# EAGLE design SAMD11 Arduino Form Factor (EAGLE 9.4.2)
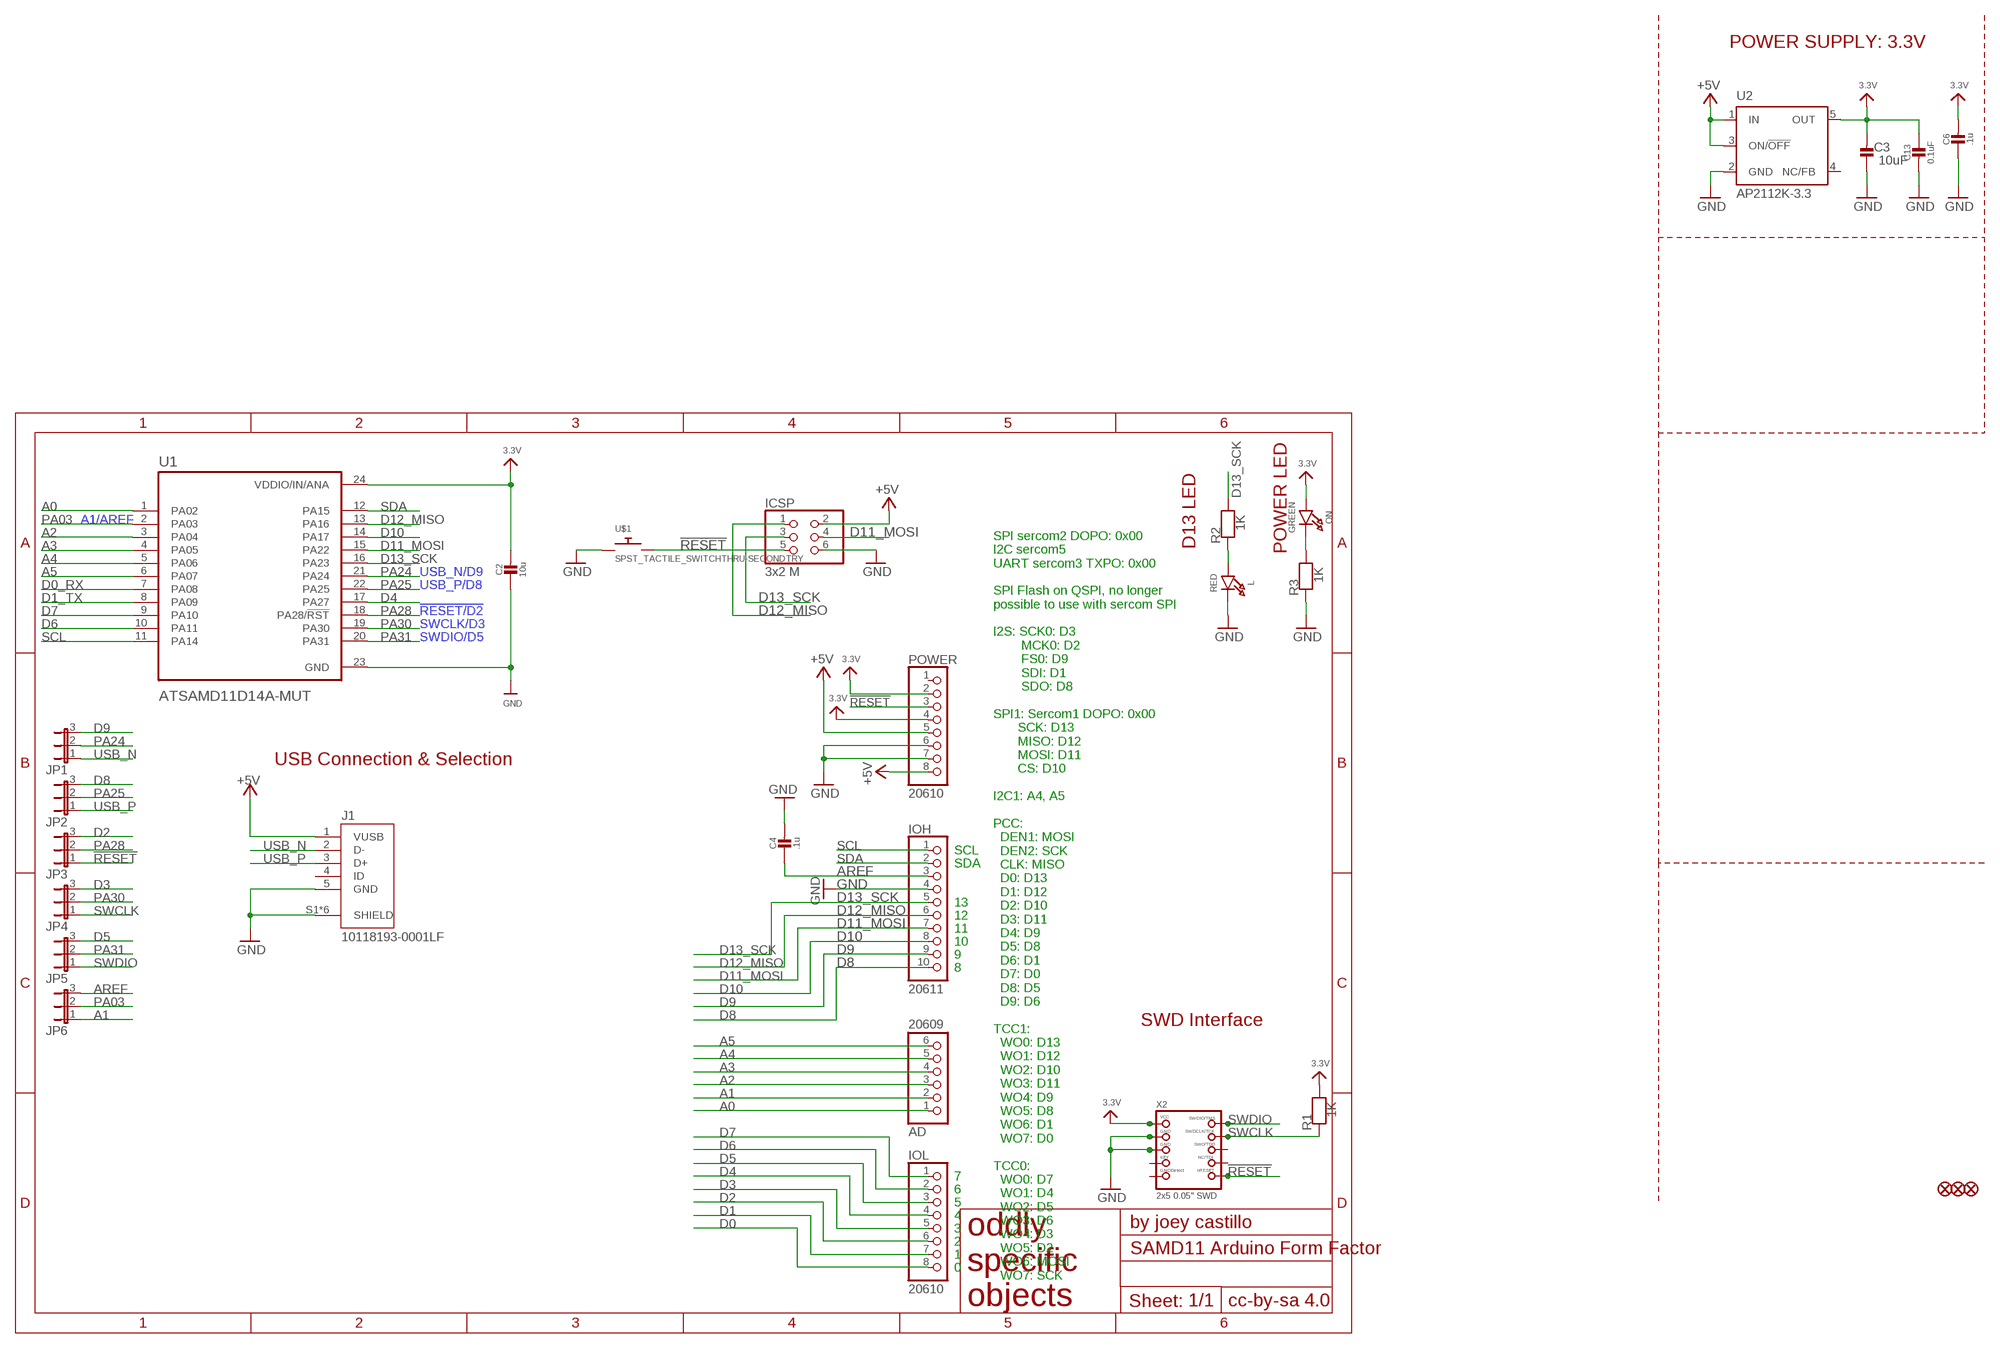
[diagram p0: schematic, sheet 1]

## Parts
AD  20609  HEADER-1X6OVALWAVE  [1X06_OVALWAVE]
C2  10u  CAP_CERAMIC0805-NOOUTLINE  [0805-NO]
C3  10uF  CAP_CERAMIC0805-NOOUTLINE  [0805-NO]
C4  .1u  CAP_CERAMIC0805-NOOUTLINE  [0805-NO]
C6  .1u  CAP_CERAMIC0805-NOOUTLINE  [0805-NO]
C13  0.1uF  CAP_CERAMIC0805-NOOUTLINE  [0805-NO]
FD1  FIDUCIAL_1MM  [FIDUCIAL_1MM]
FD2  FIDUCIAL_1MM  [FIDUCIAL_1MM]
FD3  FIDUCIAL_1MM  [FIDUCIAL_1MM]
ICSP  3x2 M  HEADER-2X3  [2X03_ROUND_70MIL]
IOH  20611  HEADER-1X10OVALWAVE  [1X10_OVALWAVE]
IOL  20610  HEADER-1X8OVALWAVE  [1X08_OVALWAVE]
J1  10118193-0001LF  [FCI_10118193-0001LF]
JP1  JP2E  [JP2]
JP2  JP2E  [JP2]
JP3  JP2E  [JP2]
JP4  JP2E  [JP2]
JP5  JP2E  [JP2]
JP6  JP2E  [JP2]
L  RED  LED0805_NOOUTLINE  [CHIPLED_0805_NOOUTLINE]
ON  GREEN  LED0805_NOOUTLINE  [CHIPLED_0805_NOOUTLINE]
POWER  20610  HEADER-1X8OVALWAVE  [1X08_OVALWAVE]
R1  1K  RESISTOR0805_NOOUTLINE  [0805-NO]
R2  1K  RESISTOR0805_NOOUTLINE  [0805-NO]
R3  1K  RESISTOR0805_NOOUTLINE  [0805-NO]
U1  ATSAMD11D14A-MUT  [QFN50P400X400X90-25N]
U2  AP2112K-3.3  LP2985-XXDBVR33  [SOT23-DBV]
U$1  SPST_TACTILE_SWITCHTHRU-SECONDTRY  [MJTP1250-TRY2]
X2  2x5 0.05" SWD  JTAG-CORTEXBOXPOSTS  [2X05_1.27MM_BOX_POSTS]

## Nets
3.3V: C2.2 C3.2 C6.2 C13.1 ON.A POWER.2 POWER.4 R1.2 U1.24(VDDIO/IN/ANA) U2.5(OUT) X2.1(VCC)
!RESET: ICSP.5 JP3.1 POWER.3 U$1.P$2 X2.10(NRESET)
+5V [usbvcc]: ICSP.2 POWER.5 POWER.8 U2.1(IN) U2.3(ON/!OFF)
A0: AD.1 U1.1(PA02)
A1: AD.2 JP6.1
A2: AD.3 U1.3(PA04)
A3: AD.4 U1.4(PA05)
A4: AD.5 U1.5(PA06)
A5: AD.6 U1.6(PA07)
AREF [aref]: C4.1 IOH.3 JP6.3
D0: IOL.8
D0_RX: U1.7(PA08)
D1: IOL.7
D1_TX: U1.8(PA09)
D2: IOL.6 JP3.3
D3: IOL.5 JP4.3
D4: IOL.4 U1.17(PA27)
D5: IOL.3 JP5.3
D6: IOL.2 U1.10(PA11)
D7: IOL.1 U1.9(PA10)
D8: IOH.10 JP2.3
D9: IOH.9 JP1.3
D10: IOH.8 U1.14(PA17)
D11_MOSI: ICSP.4 IOH.7 U1.15(PA22)
D12_MISO: ICSP.1 IOH.6 U1.13(PA16)
D13_SCK: ICSP.3 IOH.5 R2.2 U1.16(PA23)
GND [gnd]: C2.1 C3.1 C4.2 C6.1 C13.2 ICSP.6 IOH.4 J1.5(GND) J1.S1(SHIELD) J1.S2(SHIELD) J1.S3(SHIELD) J1.S4(SHIELD) J1.S5(SHIELD) J1.S6(SHIELD) L.C POWER.6 POWER.7 R3.1 U1.23(GND) U2.2(GND) U$1.P$1 X2.3(GND) X2.5(GND)
N$1: L.A R2.1
N$3: ON.C R3.2
N$6: J1.1(VUSB) ; supply symbol labelled +5V
PA03: JP6.2 U1.2(PA03)
PA24: JP1.2 U1.21(PA24)
PA25: JP2.2 U1.22(PA25)
PA28: JP3.2 U1.18(PA28/!RST)
PA30: JP4.2 U1.19(PA30)
PA31: JP5.2 U1.20(PA31)
SCL: IOH.1 U1.11(PA14)
SDA: IOH.2 U1.12(PA15)
SWCLK: JP4.1 R1.1 X2.4(SWDCLK)
SWDIO: JP5.1 X2.2(SWDIO)
USB_N: J1.2(D-) JP1.1
USB_P: J1.3(D+) JP2.1
Unconnected: J1.4(ID) POWER.1 U2.4(NC/FB) X2.6(SWO) X2.7(KEY) X2.8(TDI) X2.9(GNDDETECT)

## Notes on the sheet
- POWER SUPPLY: 3.3V
- POWER LED
- D13 LED
- A1/AREF
- USB_N/D9
- USB_P/D8
- !RESET/D2
- SWCLK/D3
- SWDIO/D5
- USB Connection & Selection
- SCL
- SDA
- 13
- 12
- 11
- 10
- 9
- 8
- SWD Interface
- 7
- 6
- 5
- 4
- 3
- 2
- 1
- 0
- SPI sercom2 DOPO: 0x00
  I2C sercom5
  UART sercom3 TXPO: 0x00
  
  SPI Flash on QSPI, no longer
  possible to use with sercom SPI
  
  I2S: SCK0: D3
          MCK0: D2
          FS0: D9
          SDI: D1
          SDO: D8
  
  SPI1: Sercom1 DOPO: 0x00
         SCK: D13
         MISO: D12
         MOSI: D11
         CS: D10
  
  I2C1: A4, A5
  
  PCC:
    DEN1: MOSI
    DEN2: SCK
    CLK: MISO
    D0: D13
    D1: D12
    D2: D10
    D3: D11
    D4: D9
    D5: D8
    D6: D1
    D7: D0
    D8: D5
    D9: D6
  
  TCC1:
    WO0: D13
    WO1: D12
    WO2: D10
    WO3: D11
    WO4: D9
    WO5: D8
    WO6: D1
    WO7: D0
  
  TCC0:
    WO0: D7
    WO1: D4
    WO2: D5
    WO3: D6
    WO4: D3
    WO5: D2
    WO6: MOSI
    WO7: SCK

## Library data of the parts
AD = microbuilder:HEADER-1X6: PIN HEADER
C2-C4 C6 C13 = microbuilder:CAP_CERAMIC: Ceramic Capacitors For new designs, use the packages preceded by an '_' character since they are more reliable: The following footprints should be used on most boards: _0402 - Standard footprint for regular board layouts _0603 - Standard footprint for regular board layouts _0805 - Standard footprint for regular board layouts _1206 - Standard footprint for regular board layouts For extremely tight-pitch boards where space is at a premium, the following 'micro-pitch' footprints can be used (smaller pads, no silkscreen outline, etc.): _0402MP - Micro-pitch footprint for very dense/compact boards _0603MP - Micro-pitch footprint for very dense/compact boards _0805MP - Micro-pitch footprint for very dense/compact boards _1206MP - Micro-pitch footprint for very dense/compact boards
FD1-FD3 = microbuilder:FIDUCIAL: Fiducial Alignment Points Various fiducial points for machine vision alignment.; BOM: EXCLUDE
ICSP = microbuilder:HEADER-2X3: PIN HEADER
IOH = microbuilder:HEADER-1X10: PIN HEADER
IOL POWER = microbuilder:HEADER-1X8: PIN HEADER
J1 = 10118193-0001LF:10118193-0001LF: Micro USB B Type Receptacle; DESCRIPTION: Single Port 5 Contact Shielded SMT MICRO USB B-Type Receptacle; DIGI-KEY_PART_NUMBER: 609-4616-1-ND; DIGI-KEY_PURCHASE_URL: https://www.digikey.com/product-detail/en/amphenol-icc-fci/10118193-0001LF/609-4616-1-ND/2785380?utm_source=snapeda&utm_medium=aggregator&utm_campaign=symbol; MF: Amphenol ICC; MP: 10118193-0001LF; PACKAGE: None
JP1-JP6 = jumper:JP2E: JUMPER
L ON = microbuilder:LED: LED 0603 - 0603 Surface Mount Package 2mA: Green LED - Low Power (3.9mcd, 2ma, 1.7Vf) - Digikey: 475-2709-2-ND Orange LED - Low Power (9.8mcd, 2ma, 1.8Vf) - Digikey: 475-1194-2-ND Red LED - Low Power (5mcd, 2ma, 1.8Vf) - Digikey: 475-1195-2-ND Yellow LED - Low Power (7mcd, 2ma, 1.8Vf) - Digikey: 475-1196-2-ND 5mA: Blue LED - Low Power (17mcd, 5ma, 2.9Vf) - Digikey: LNJ937W8CRACT-ND 0805 - 0805 Surface Mount Package 2mA: Red LED (8.8mcd, 2mA, 1.8Vf, Clear) - Low Power [Digikey: 475-2510-1-ND] Green LED (5mcd, 2mA, 1.8Vf, Clear) - Low Power [Digikey: 475-2730-1-ND] Yellow LED (11.3mcd, 2mA, 1.8Vf, Clear) - Low Power [Digikey: 475-2555-1-ND] 20mA: Red LED (104mcd, 20mA, Diffused) - LS R976 [Digikey: 475-1278-6-ND] Red LED (12mcd, 20mA, 2.0Vf, Clear) - APT2012EC [Digikey: 754-1128-1-ND] Green LED (15mcd, 20mA, 2.2Vf, Clear) - APT2012GC [Digikey: 754-1131-1-ND] Orange LED (160mcd, 20mA, 2.1Vf, Clear) - APT2012SECK [Digikey: 754-1130-1-ND] 1206 - 1206 Surface Mount Package Green LED (26mcd, 20mA, Diffused) - LG N971 [Digikey: 475-1407-6-ND] Red LED (15mcd, 20mA, Diffused) - LH N974 [Digikey: 475-1416-6-ND] Cree - Cree High-Power Surface Mount LEDs XPEBWT-L1-0000-00D50 - White 111lm 350mA 2.9Vf 6200K 110° XTEAWT-00-0000-00000LEE3 - White 114lm 350mA 2.85Vf 5000K 115° Everlight - Everlight 45-21 Series Surface Mount LEDs 45-21/QK2C-B2832AC2CB2/2T - Warm White 2000mcd 20mA 3.25Vf 3050K 120° 45-21/LK2C-B38452C4CB2/2T - Nuetral White 2000mcd 20mA 3.25Vf 4150K 120° 45-21/LK2C-B50634C6CB2/2T - Cold White 2200mcd 20mA 3.25Vf 5650K 120° PLCC2 Reverse Mount LS T77K-J1L2-1-0-2-R18-Z - Red 11.25mcd 2mA 1.8Vf 630nm 120° LO T77K-L1M2-24-Z - Orange 19.6mcd 2mA 1.8Vf 606nm 120° LY T77K-K2M1-26-Z - Yellow 15.7mcd 2mA 1.8Vf 587nm 120°
R1-R3 = microbuilder:RESISTOR: Resistors For new designs, use the packages preceded by an '_' character since they are more reliable: The following footprints should be used on most boards: _0402 - Standard footprint for regular board layouts _0603 - Standard footprint for regular board layouts _0805 - Standard footprint for regular board layouts _1206 - Standard footprint for regular board layouts For extremely tight-pitch boards where space is at a premium, the following 'micro-pitch' footprints can be used (smaller pads, no silkscreen outline, etc.): _0402MP - Micro-pitch footprint for very dense/compact boards _0603MP - Micro-pitch footprint for very dense/compact boards _0805MP - Micro-pitch footprint for very dense/compact boards _1206MP - Micro-pitch footprint for very dense/compact boards
U1 = ATSAMD11D14A-MUT:ATSAMD11D14A-MUT: None; AVAILABILITY: Unavailable; DESCRIPTION: Cortex-M0+, 16KB FLASH, 4KB SRAM, USB - 24 QFN, INDUSTRIAL, GREEN, 1.6-3.6V, 48MHz/ QFN _ZA_; MF: Microchip; MP: ATSAMD11D14A-MUT; PACKAGE: QFN-24 Microchip; PRICE: None
U2 = SmartPrj:LP2985-XXDBVR: ULTRALOW-POWER 50-mA LOW-DROPOUT LINEAR REGULATORS 50-mA Low-Dropout Regulator Source: http://focus.ti.com/lit/ds/symlink/tps77001.pdf
U$1 = My Stuff:SPST_TACTILE_SWITCH
X2 = microbuilder:JTAG-CORTEX: Serial Wire (SW-DP) Connector Standard 0.05" 10-pin connector is for use with the Cortex M and Cortex A SWD (serial wire debugger) interface (SW-DP) Connectors 2x05_1.27MM_SMT - Inexpensive surface-mount header with bare pins, compatible with standard 10-pin SWD cables (4UCON: 16846) 2x05_1.27MM_BOX_NOPOSTS - Polarised surface-mount box (4UCON with caps: 19735, without caps: 15117 2x05_1.27MM_BOX_POSTS - Polarised surface-mount box with mounting holes (4UCON: 20317) Pinout: http://infocenter.arm.com/help/topic/com.arm.doc.faqs/attached/13634/cortex_debug_connectors.pdf http://www.keil.com/peripherals/coresight/connectors.asp

## Board
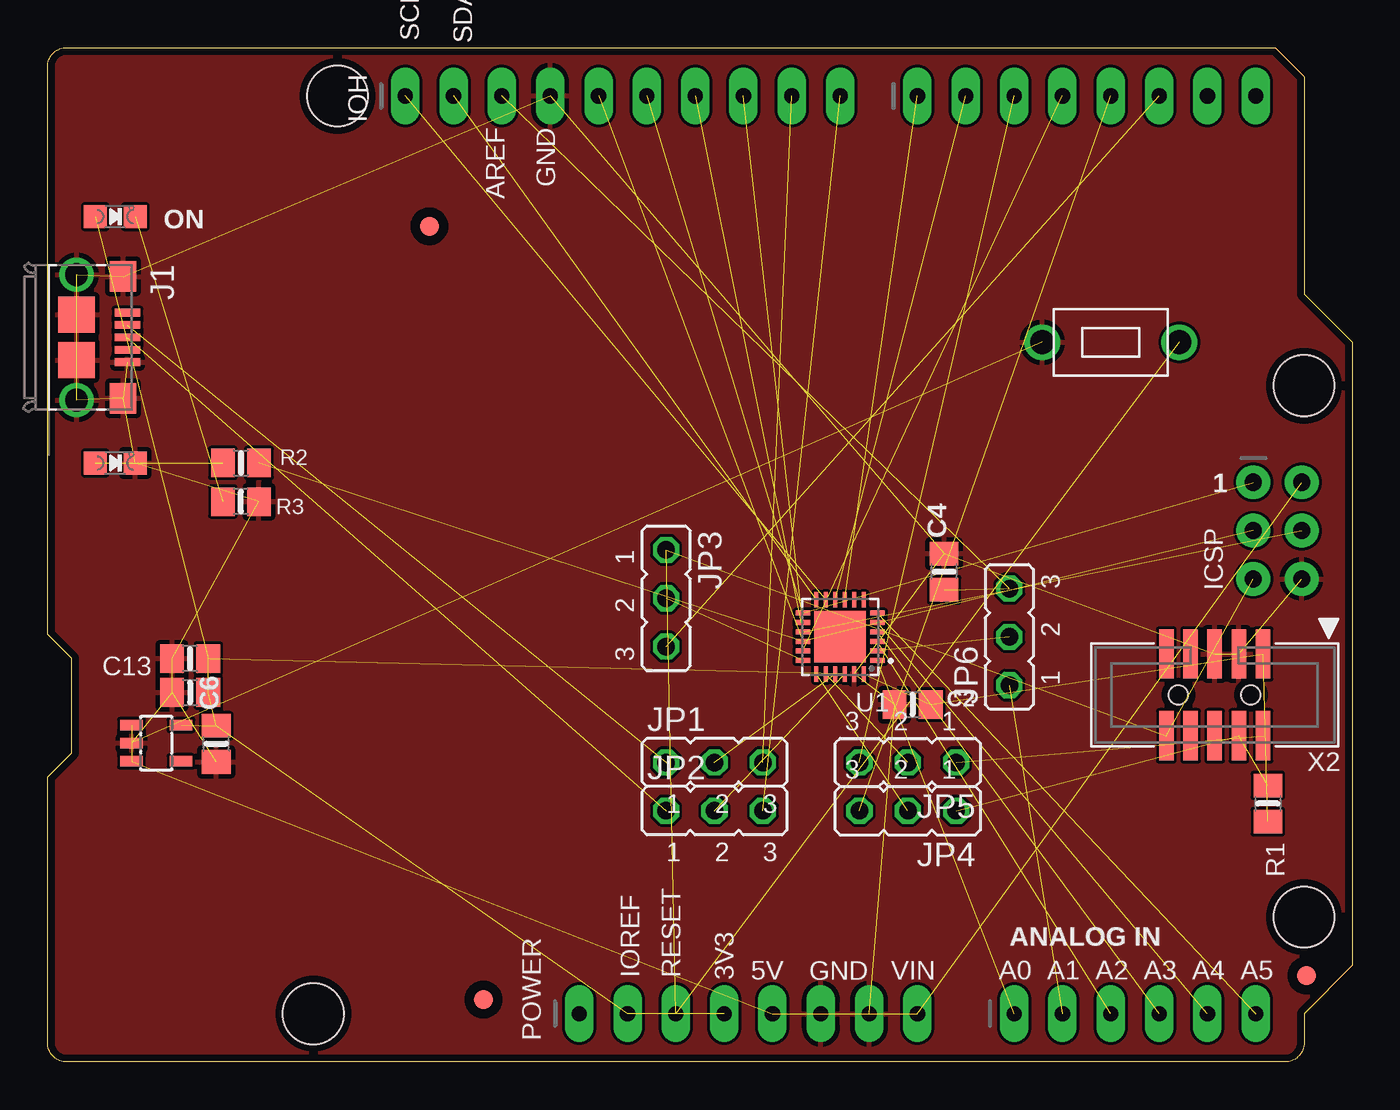
[diagram p1: board, top side]
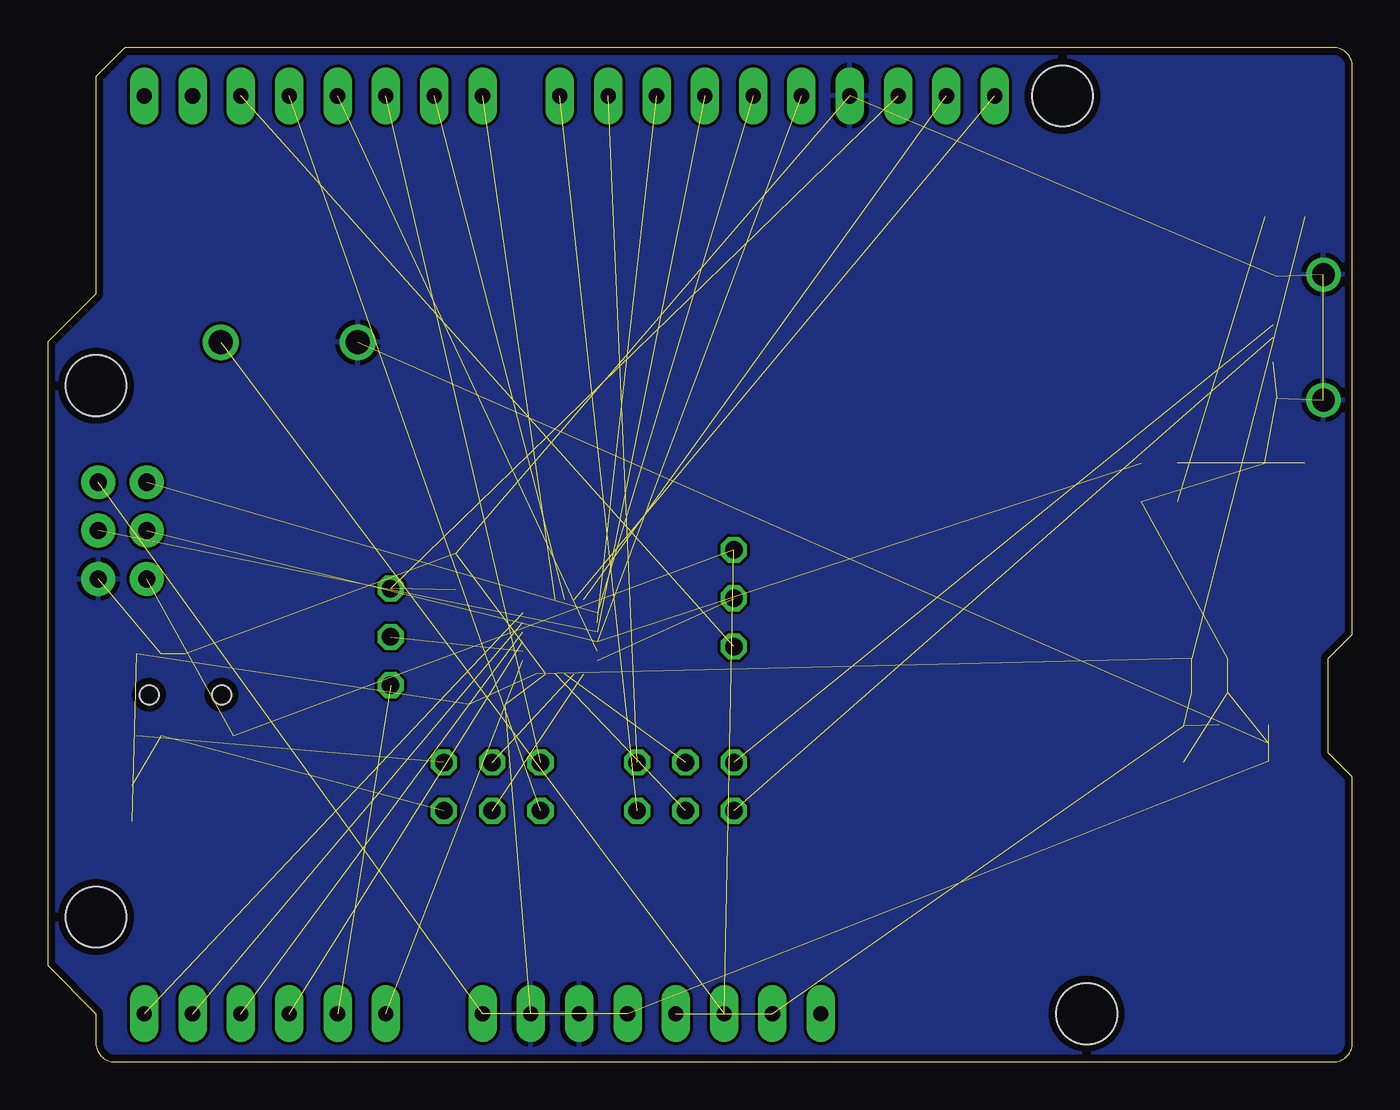
[diagram p2: board, bottom side, seen from below]

Size 68.58 x 53.34 mm. Coordinates in mm from the lower left corner, seen from the top.
Outline: 64.52,53.34 66.04,51.82 66.04,40.39 68.58,37.85 68.58,5.08 66.04,2.54 66.04,1 arc-90 65.04,0 1,0 arc-90 0,1 0,14.99 1.27,16.26 1.27,21.21 0,22.48 0,52.34 arc-90 1,53.34 64.52,53.34
Copper layers (1*16): Top 0.035559375mm / dielectric 1.6mm / Bottom 0.035559375mm
Design rules "oshpark-2layer": minimum track width 6mil, minimum drill 10mil, track to track 6mil, track to pad 6mil, pad to pad 6mil, via to via 6mil, smd to smd 6mil, copper to edge 15mil, drill to drill 6mil, minimum pad ring 5mil, minimum via ring 5mil, stop-mask expansion 2.5mil, vias tented up to drill 0mil, thermal gap 10mil
Holes 3.2 mm at 66.04,35.56 66.04,7.62 15.24,50.8 13.97,2.54

### Footprints (pad centres in the part's own frame; a part is rotated, then mirrored left to right if it is on the bottom)
1X06_OVALWAVE = drill 0.8 pad 1.5 long: 1 -6.35,0; 2 -3.81,0; 3 -1.27,0; 4 1.27,0; 5 3.81,0; 6 6.35,0
0805-NO = smd 1.24 x 1.5: 1 -0.95,0; 2 0.95,0
FIDUCIAL_1MM = smd 1 x 1: 1 0,0
2X03_ROUND_70MIL = drill 0.9 pad 1.778: 1 -2.54,-1.27; 2 -2.54,1.27; 3 0,-1.27; 4 0,1.27; 5 2.54,-1.27; 6 2.54,1.27
1X10_OVALWAVE = drill 0.8 pad 1.5 long: 1 -11.43,0; 2 -8.89,0; 3 -6.35,0; 4 -3.81,0; 5 -1.27,0; 6 1.27,0; 7 3.81,0; 8 6.35,0; 9 8.89,0; 10 11.43,0
1X08_OVALWAVE = drill 0.8 pad 1.5 long: 1 -8.89,0; 2 -6.35,0; 3 -3.81,0; 4 -1.27,0; 5 1.27,0; 6 3.81,0; 7 6.35,0; 8 8.89,0
FCI_10118193-0001LF = smd 0.4 x 1.35: 1 -1.3,2.675; 2 -0.65,2.675; 3 0,2.675; 4 0.65,2.675; 5 1.3,2.675 | smd 1.6 x 1.4: S1 -3.2,2.45; S2 3.2,2.45 | smd 1.9 x 1.9: S3 1.2,0; S4 -1.2,0 | drill 1.2: S5 3.302,0; S6 -3.302,0
JP2 = drill 0.914 octagon: 1 -2.54,0; 2 0,0; 3 2.54,0
CHIPLED_0805_NOOUTLINE = smd 1.2 x 1.2: A 0,-1.05; C 0,1.05
QFN50P400X400X90-25N = smd 0.81 x 0.27: 1 -1.955,1.25; 2 -1.955,0.75; 3 -1.955,0.25; 4 -1.955,-0.25; 5 -1.955,-0.75; 6 -1.955,-1.25; 13 1.955,-1.25; 14 1.955,-0.75; 15 1.955,-0.25; 16 1.955,0.25; 17 1.955,0.75; 18 1.955,1.25 | smd 0.27 x 0.81: 7 -1.25,-1.955; 8 -0.75,-1.955; 9 -0.25,-1.955; 10 0.25,-1.955; 11 0.75,-1.955; 12 1.25,-1.955; 19 1.25,1.955; 20 0.75,1.955; 21 0.25,1.955; 22 -0.25,1.955; 23 -0.75,1.955; 24 -1.25,1.955 | smd 2.7 x 2.7: 25 0,0
SOT23-DBV = smd 0.55 x 1.2: 1 -0.95,-1.3; 2 0,-1.3; 3 0.95,-1.3; 4 0.95,1.3; 5 -0.95,1.3
MJTP1250-TRY2 = drill 1.25: P$1 -3.6,0; P$2 3.6,0
2X05_1.27MM_BOX_POSTS = smd 0.76 x 2.6: 1 -2.54,-2.15; 2 -2.54,2.15; 3 -1.27,-2.15; 4 -1.27,2.15; 5 0,-2.15; 6 0,2.15; 7 1.27,-2.15; 8 1.27,2.15; 9 2.54,-2.15; 10 2.54,2.15 | hole 1: -1.905,0; 1.905,0

### Placement (x,y rotation side)
AD  57.15,2.54 0 top
C2  45.47,18.8 0 top
C3  7.49,19.43 0 top
C4  47.12,25.78 90 top
C6  8.87,16.73 90 top
C13  7.49,21.21 180 top
FD1  20.07,43.94 0 top
FD2  66.16,4.55 0 top
FD3  22.91,3.28 0 top
ICSP  64.64,27.94 270 top
IOH  30.23,50.8 0 top
IOL  54.61,50.8 0 top
J1  1.52,38.1 270 top
JP1  35.05,15.75 0 top
JP2  35.05,13.21 0 top
JP3  32.51,24.38 270 top
JP4  45.21,13.21 180 top
JP5  45.21,15.75 180 top
JP6  50.55,22.35 90 top
L  3.56,31.5 270 top
ON  3.56,44.45 270 top
POWER  36.83,2.54 0 top
R1  64.14,13.59 270 top
R2  10.16,31.5 0 top
R3  10.16,29.46 180 top
U1  41.66,22.35 180 top
U2  5.71,16.76 270 top
U$1  55.88,37.85 0 top
U$23  [METROM4_REVF_TOP]  0,0 0 top
U$27  [METROM4_REVF_BOT]  68.58,0 0 bottom
X2  61.34,19.3 180 top

### Tracks (layer width: path | path; a pad name or v marks a point on that pad's centre or on a via)
3.3V  (10 unrouted)
!RESET  (4 unrouted)
+5V  (4 unrouted)
A0  (1 unrouted)
A1  (1 unrouted)
A2  (1 unrouted)
A3  (1 unrouted)
A4  (1 unrouted)
A5  (1 unrouted)
AREF  (2 unrouted)
D2  (1 unrouted)
D3  (1 unrouted)
D4  (1 unrouted)
D5  (1 unrouted)
D6  (1 unrouted)
D7  (1 unrouted)
D8  (1 unrouted)
D9  (1 unrouted)
D10  (1 unrouted)
D11_MOSI  (2 unrouted)
D12_MISO  (2 unrouted)
D13_SCK  (3 unrouted)
GND  (22 unrouted)
  pour Bottom (rank 5): 0,53.34 68.58,53.34 68.58,0 0,0
  pour Top (rank 5): 0,53.34 70.1,53.34 70.1,0 0,0
N$1  (1 unrouted)
N$3  (1 unrouted)
PA03  (1 unrouted)
PA24  (1 unrouted)
PA25  (1 unrouted)
PA28  (1 unrouted)
PA30  (1 unrouted)
PA31  (1 unrouted)
SCL  (1 unrouted)
SDA  (1 unrouted)
SWCLK  (2 unrouted)
SWDIO  (1 unrouted)
USB_N  (1 unrouted)
USB_P  (1 unrouted)

### Text on the board
tNames: SCL | SDA | AREF | GND | 1 | ANALOG IN | IOREF | RESET | 3V3 | 5V | GND | VIN | A0 | A1 | A2 | A3 | A4 | A5
214bmp: D:/SmartProjects/Snc/a4_bn_logo2.bmp